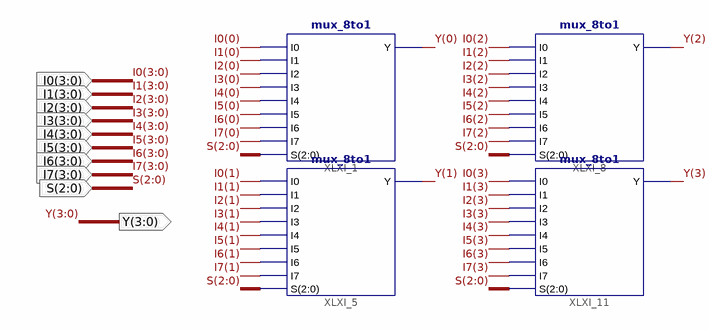
[diagram p0: schematic sheet 1]
// Xilinx ISE schematic mux_4bit_8to1.sch (virtex6) as structural Verilog: 4 symbols, 10 ports
module mux_4bit_8to1 (
  input  [3:0] I0,
  input  [3:0] I1,
  input  [3:0] I2,
  input  [3:0] I3,
  input  [3:0] I4,
  input  [3:0] I5,
  input  [3:0] I7,
  input  [2:0] S,
  input  [3:0] I6,
  output [3:0] Y
);

  mux_8to1 XLXI_1 (
    .S(S), .I0(I0[0]), .I1(I1[0]), .I2(I2[0]), .I3(I3[0]), .I4(I4[0]), .I5(I5[0]), .I6(I6[0]), .I7(I7[0]),
    .Y(Y[0]));
  mux_8to1 XLXI_5 (
    .S(S), .I0(I0[1]), .I1(I1[1]), .I2(I2[1]), .I3(I3[1]), .I4(I4[1]), .I5(I5[1]), .I6(I6[1]), .I7(I7[1]),
    .Y(Y[1]));
  mux_8to1 XLXI_8 (
    .S(S), .I0(I0[2]), .I1(I1[2]), .I2(I2[2]), .I3(I3[2]), .I4(I4[2]), .I5(I5[2]), .I6(I6[2]), .I7(I7[2]),
    .Y(Y[2]));
  mux_8to1 XLXI_11 (
    .S(S), .I0(I0[3]), .I1(I1[3]), .I2(I2[3]), .I3(I3[3]), .I4(I4[3]), .I5(I5[3]), .I6(I6[3]), .I7(I7[3]),
    .Y(Y[3]));
endmodule
